# EAGLE design C64_AV-Adaptor (EAGLE 9.6.2)
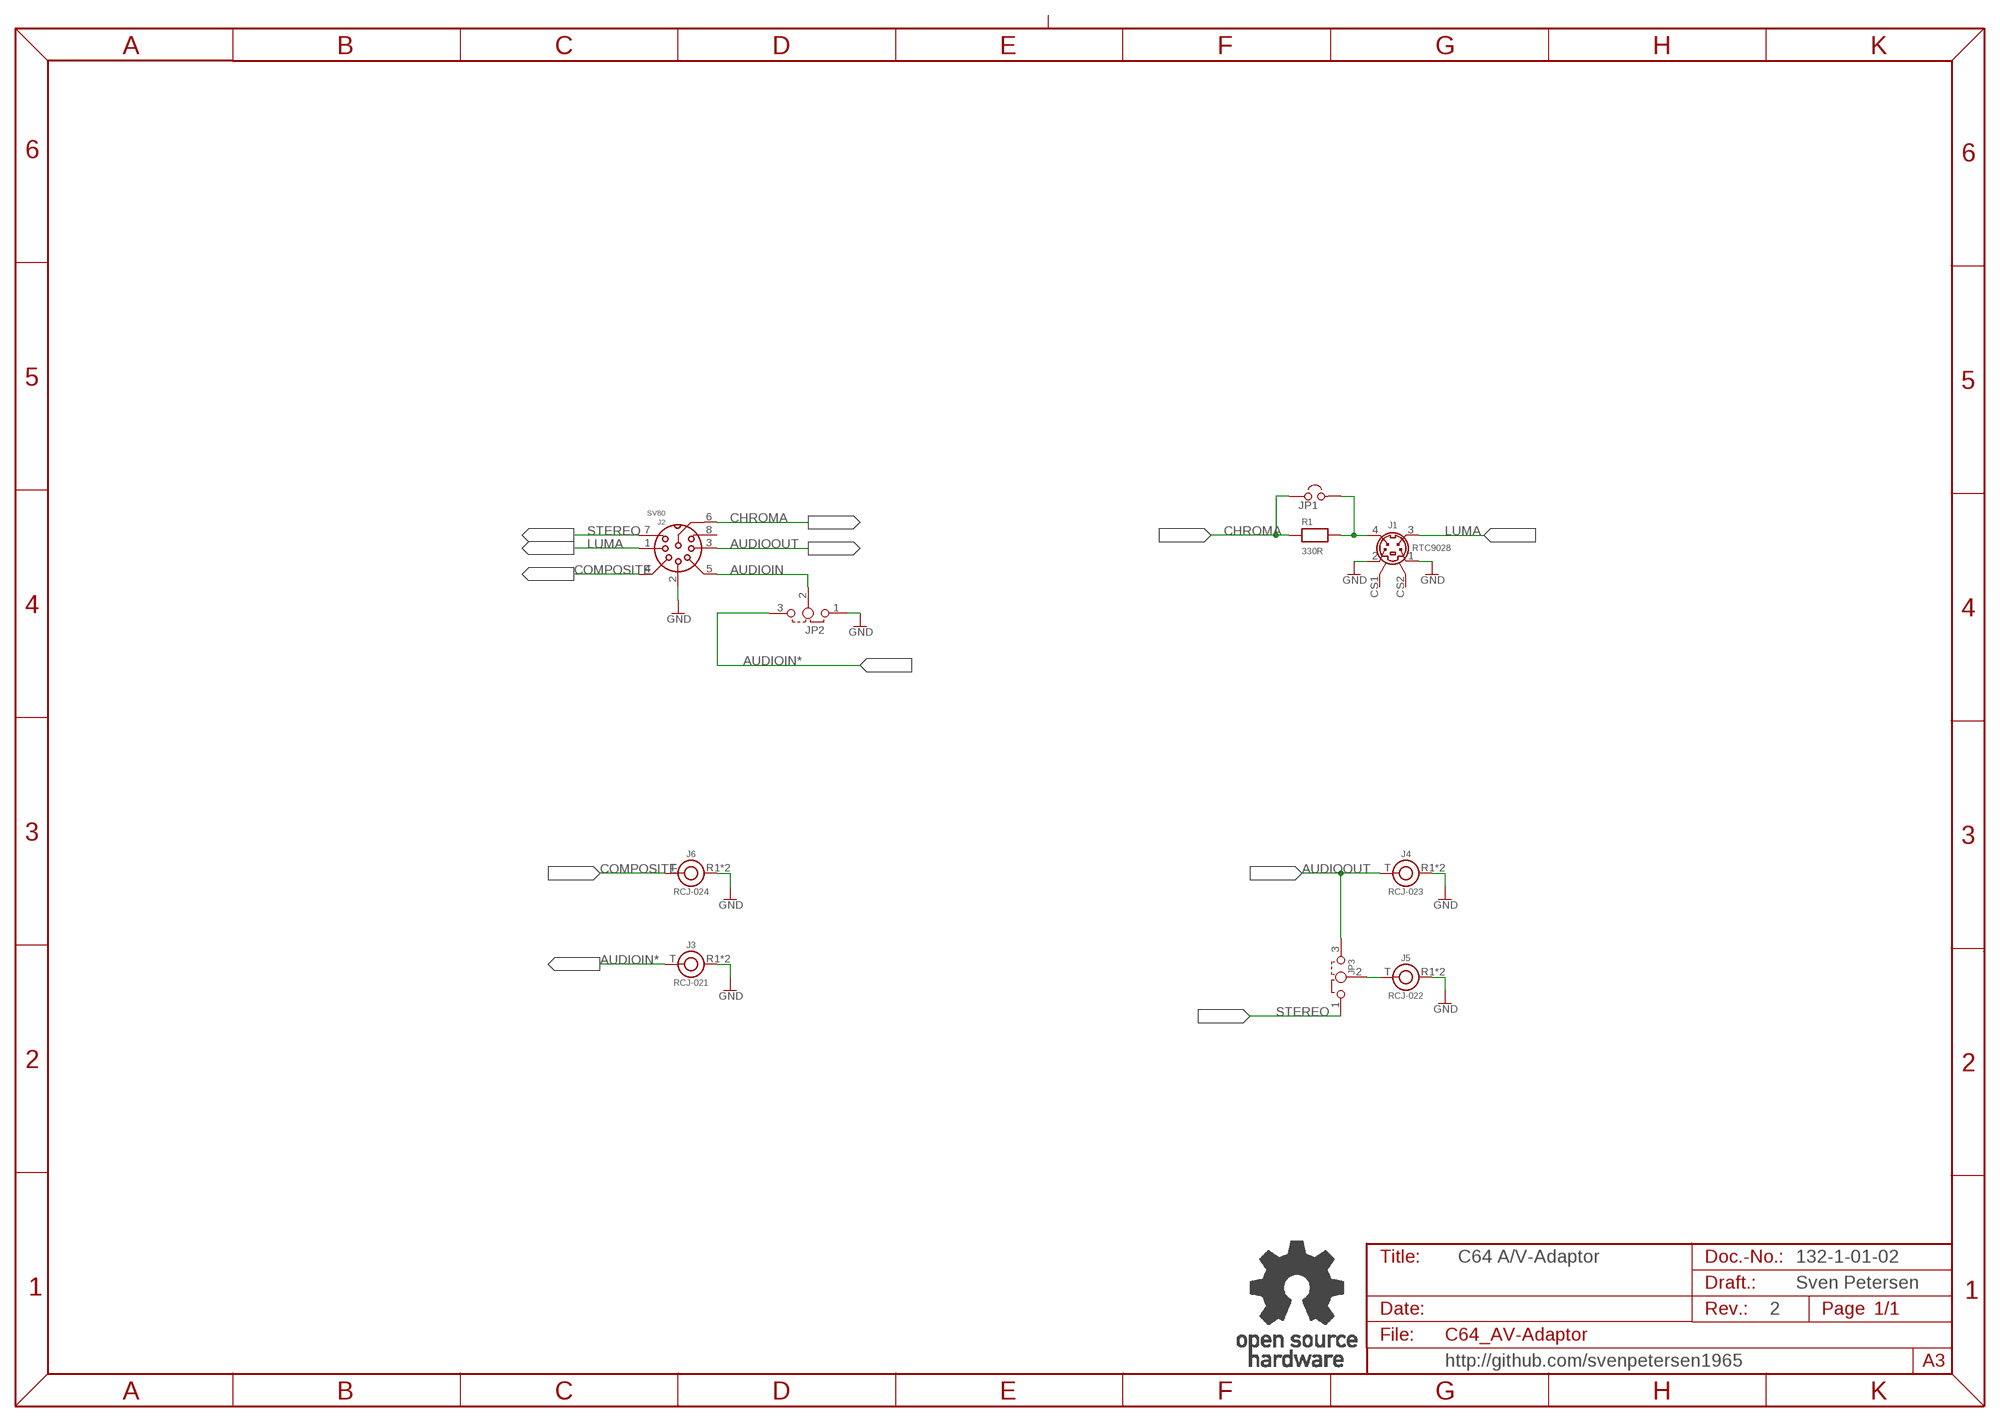
[diagram p0: schematic, sheet 1]

## Parts
J1  RTC9028  [MINIDIN4_V]
J2  SV80  [SV80_INNER]
J3  RCJ-021  RCJ-02X  [RCJ-02X]
J4  RCJ-023  RCJ-02X  [RCJ-02X]
J5  RCJ-022  RCJ-02X  [RCJ-02X]
J6  RCJ-024  RCJ-02X  [RCJ-02X]
JP1  JUMPER  [1X02]
JP2  DJUMPER  [1X03]
JP3  DJUMPER  [1X03]
R1  330R  RES04  [R-10]
U$25  OPEN_SOURCE_HW  [OPENHW]

## Nets
AUDIOIN: J2.5 JP2.2
AUDIOIN*: J3.T JP2.3
AUDIOOUT: J2.3 J4.T JP3.3
AUDIOR: J5.T JP3.2
CHROMA: J2.6 JP1.1 R1.1
COMPOSITE: J2.4 J6.T
GND: J1.1 J1.2 J2.2 J3.R1(R) J3.R2(R) J4.R1(R) J4.R2(R) J5.R1(R) J5.R2(R) J6.R1(R) J6.R2(R) JP2.1
LUMA: J1.3 J2.1
N$1: J1.4 JP1.2 R1.2
STEREO: J2.7 JP3.1
Unconnected: J1.CS1 J1.CS2 J2.8

## Notes on the sheet
- C64 A/V-Adaptor | 132-1-01-02
- Sven Petersen
- 2
- http://github.com/svenpetersen1965

## Library data of the parts
J1 = RTConnector:RTC9028: Mini-DIN, 4p, vertical
J2 = Lumberg:SV80: Inner part of SV80
J3-J6 = CUI_INC:RCJ-02X
JP1 = PINHEAD:JUMPER
JP2 JP3 = PINHEAD:DJUMPER
R1 = DISCRETE:RES04
U$25 = Logo:OPEN_SOURCE_HW

## Board
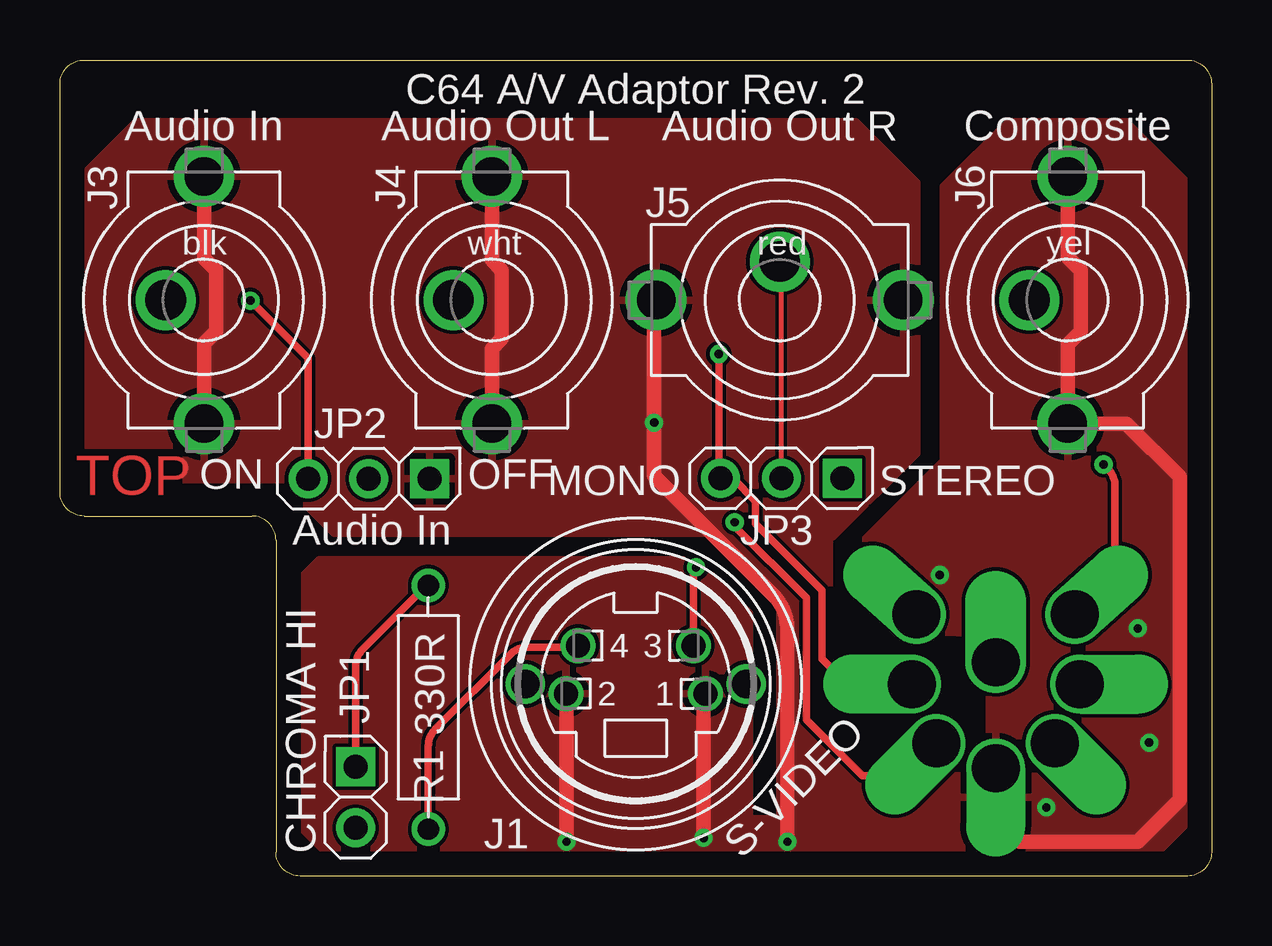
[diagram p1: board, top side]
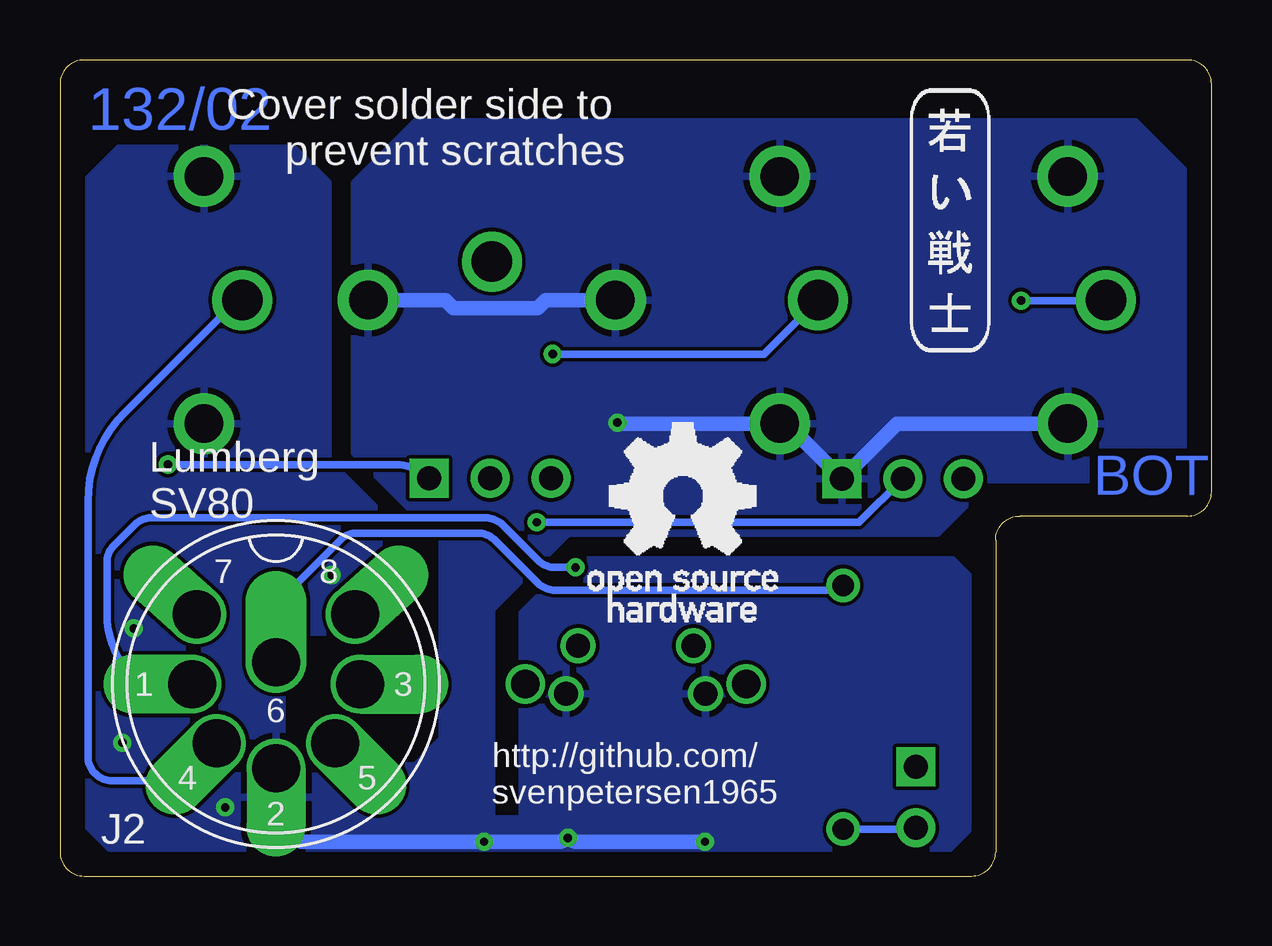
[diagram p2: board, bottom side, seen from below]

Size 48 x 34 mm. Coordinates in mm from the lower left corner, seen from the top.
Outline: 1,34 47,34 arc-90 48,33 48,1 arc-90 47,0 10,0 arc-90 9,1 9,14 arc90 8,15 1,15 arc-90 0,16 0,33 arc-90 1,34
Copper layers (1*16): Top 0.035mm / dielectric 1.5mm / Bottom 0.035mm
Design rules "default *": minimum track width 6mil, minimum drill 0.35mm, track to track 6mil, track to pad 6mil, pad to pad 6mil, via to via 6mil, smd to smd 6mil, copper to edge 40mil, drill to drill 6mil, minimum pad ring 9mil, minimum via ring 8mil, stop-mask expansion 4mil, vias tented up to drill 25mil, thermal gap 10mil
tRestrict: 2 lines
bRestrict: 3 lines

### Footprints (pad centres in the part's own frame; a part is rotated, then mirrored left to right if it is on the bottom)
MINIDIN4_V = drill 1: 1 2.9,-0.4; 2 -2.9,-0.4; 3 2.4,1.6; 4 -2.4,1.6 | drill 1.2: CS1 4.6,0; CS2 -4.6,0
SV80_INNER = drill 2 pad 2.413 offset: 1 3.5,0; 2 0,3.5; 3 -3.5,0; 4 2.47,2.47; 5 -2.47,2.47; 7 3.3,-2.9; 8 -3.3,-2.9 | drill 2 pad 2.54 offset: 6 0,-0.9
RCJ-02X = drill 1.6 pad 2.54: R1 -5.15,0; R2 5.15,0 | drill 1.7 pad 2.5: T 0,1.6
1X02 = drill 1 pad 1.626 square: 1 -1.27,0 | drill 1 pad 1.626: 2 1.27,0
1X03 = drill 1 pad 1.626 square: 1 -2.54,0 | drill 1 pad 1.626: 2 0,0; 3 2.54,0
R-10 = drill 0.889 pad 1.397: 1 -5.08,0; 2 5.08,0

### Placement (x,y rotation side)
J1  24,8 0 top
J2  39,8 180 bottom
J3  6,24 90 top
J4  18,24 90 top
J5  30,24 0 top
J6  42,24 90 top
JP1  12.32,3.27 270 top
JP2  12.87,16.56 180 top
JP3  30.07,16.57 180 top
R1  15.35,7.03 270 top
U$22  [2LAYER]  0.64,15.88 0 top
U$23  [SVEN_TAG]  10.86,27.43 0 bottom
U$24  [PCB-TITLE/]  0,46.2 0 top  (outside the outline)
U$25  25.97,10.61 0 bottom

### Tracks (layer width: path | path; a pad name or v marks a point on that pad's centre or on a via)
AUDIOIN  (via drill 0.35)
  Top 0.305: J2.5 35.19,4.18 33.44,4.18 31.11,6.51 31.11,11.59 28.12,14.58 v28.12,14.74
  Bottom 0.305: v28.12,14.74 27.46,14.74 14.69,14.74 JP2.2
AUDIOIN*  (via drill 0.35)
  Top 0.305: JP2.3 10.33,21.57 v7.94,23.97
  Bottom 0.203: 4.43,23.97 J3.T
  Bottom 0.305: v7.94,23.97 4.43,23.97
AUDIOOUT  (via drill 0.35)
  Top 0.305: J2.3 35.4,8.1 32.7,8.1 31.75,9.05 31.75,11.91 28.98,14.67 28.98,15.62 28.04,16.57 JP3.3 27.46,16.63 v27.46,21.75
  Bottom 0.305: v27.46,21.75 18.65,21.75 J4.T
AUDIOR
  Top 0.203: JP3.2 30.07,25.53 J5.T
CHROMA
  Top 0.305: JP1.1 12.32,8.72 arc-45 12.62,9.44 15.28,12.11 R1.1
  Bottom 0.305: J2.6 39,10.91 arc45 38.71,11.62 36.33,13.99 arc45 35.62,14.29 30.58,14.29 arc45 29.86,13.99 28.08,12.2 arc-45 27.36,11.91 15.84,11.91 arc-45 R1.1
COMPOSITE
  Bottom 0.305: J2.4 43.03,3.97 45.81,3.97 arc90 46.83,4.99 46.83,15.61 arc45 45.3,19.31 40.61,24 J6.T
GND  (via drill 0.35)
  Top 0.61: J2.2 39,2.85 arc45 39.29,2.14 40.01,1.43 44.93,1.43 46.67,3.17 46.67,3.97 46.67,16.63 44.45,18.85 J6.R1 42,22.16 42.55,22.7 42.55,25.24 42,25.79 J6.R2 | v26.83,1.59 26.83,7.43 arc-45 J1.1 | v21.11,1.43 21.11,7.57 arc45 J1.2 | v30.32,1.43 30.32,10.25 arc45 29.71,11.72 24.77,16.67 v24.77,18.89 24.77,23.91 J5.R1 | J3.R1 6,22.19 6.51,22.7 6.51,25.24 6,25.75 J3.R2 | J4.R1 18,21.97 18.41,22.38 18.41,25.24 18,25.66 J4.R2
  Bottom 0.61: J2.2 39,2.9 arc-45 38.71,2.19 37.94,1.43 v30.32,1.43 27.21,1.43 arc-45 v26.83,1.59 arc-45 26.45,1.43 v21.11,1.43 | J3.R1 13.12,18.85 JP2.1 17.71,18.85 J4.R1 24.72,18.85 v24.77,18.89 | J5.R1 27.75,24 28.1,23.65 31.59,23.65 31.94,24 J5.R2
  other vias: 45.4,5.56 41.12,2.86 44.93,10.32 36.67,12.54
  pour Top: 10.16,12.54 10.79,13.18 26.51,13.18 28.73,10.95 28.73,2.38 30,2.38 30,11.27 26.99,14.29 11.43,14.29 9.21,16.51 2.38,16.51 0.79,18.1 0.79,29.05 3.17,31.43 33.18,31.43 35.72,28.89 35.72,17.62 32.23,14.13 32.07,14.13 32.07,5.71 33.18,4.6 33.97,4.6 34.61,5.24 34.61,5.71 33.02,7.3 33.02,13.49 36.83,17.3 36.83,28.73 39.53,31.43 44.45,31.43 46.99,28.89 46.99,2.22 45.72,0.95 11.11,0.95 10.16,1.91
  pour Bottom: 11.11,0.95 10.16,1.91 10.16,12.54 10.79,13.18 26.51,13.18 28.73,10.95 28.73,2.38 30,2.38 30,11.11 26.83,14.29 11.43,14.29 9.21,16.51 2.38,16.51 0.79,18.1 0.79,29.05 3.17,31.43 33.18,31.43 35.72,28.89 35.72,17.62 32.07,13.97 32.07,5.71 33.18,4.6 33.97,4.6 34.61,5.24 34.61,5.71 33.02,7.3 33.02,13.49 36.83,17.3 36.83,28.89 39.37,31.43 44.45,31.43 46.99,28.89 46.99,2.22 45.72,0.95
LUMA  (via drill 0.35)
  Top 0.305: v26.51,12.86 arc45 26.4,12.59 J1.3
  Bottom 0.305: J2.1 42.82,8.32 44.97,8.32 arc45 46.04,10.89 46.04,13.07 arc45 45.74,13.79 44.91,14.62 arc45 44.19,14.92 30.26,14.92 arc45 29.55,14.63 28.08,13.16 arc-45 27.36,12.86 v26.51,12.86
N$1
  Top 0.305: R1.2 15.35,5.41 arc-45 15.65,6.13 18.75,9.23 arc-45 19.47,9.53 21.52,9.53 J1.4
  Bottom 0.305: R1.2 12.38,1.95 JP1.2
STEREO  (via drill 0.35)
  Top 0.305: J2.7 43.68,12.28 arc45 43.97,12.99 43.97,16.25 arc45 43.68,16.96 v43.5,17.14
  Bottom 0.305: v43.5,17.14 34.01,17.14 arc45 JP3.1

### Text on the board
Bottom: 132/02
tPlace: C64 A/V Adaptor Rev. 2 | Audio In | Audio Out L | Audio Out R | Composite | blk | wht | red | yel | ON | OFF | MONO | STEREO | Audio In | 330R | CHROMA HI | S-VIDEO
bPlace: Cover solder side to / prevent scratches | Lumberg / SV80 | http://github.com/ / svenpetersen1965
Document: Sven Petersen | 132-2-01-02 | 2022 | 35µm | 2 | 2